# EAGLE design blinky_ver2 (EAGLE 9.6.2)
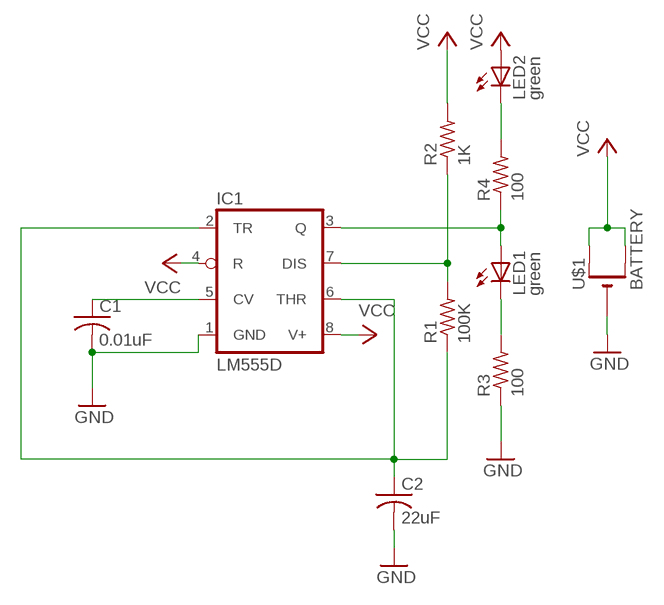
[diagram p0: schematic, sheet 1]

## Parts
C1  0.01uF  C-USC0805  [C0805]
C2  22uF  C-USC0805  [C0805]
IC1  LM555D  [SO08]
LED1  green  LEDCHIPLED_0805  [CHIPLED_0805]
LED2  green  LEDCHIPLED_0805  [CHIPLED_0805]
R1  100K  R-US_R0805  [R0805]
R2  1K  R-US_R0805  [R0805]
R3  100  R-US_R0805  [R0805]
R4  100  R-US_R0805  [R0805]
U$1  BATTERY  CR1220SMT  [CR1220-SMD]

## Nets
GND: C1.2 C2.2 IC1.1(GND) R3.1 U$1.-
N$1: LED2.C R4.2
N$2: IC1.3(Q) LED1.A R4.1
N$3: LED1.C R3.2
N$4: IC1.7(DIS) R1.2 R2.1
N$6: C1.1 IC1.5(CV)
N$7: C2.1 IC1.2(TR) IC1.6(THR) R1.1
VCC: IC1.4(R) IC1.8(V+) LED2.A R2.2 U$1.+$1(+) U$1.+$2(+1)

## Library data of the parts
C1 C2 = adafruit:C-US: CAPACITOR, American symbol
IC1 = adafruit:*555: TIMER Changed DIP package to have round (not oval) pin pads http://www.ladyada.net/library/pcb/eaglelibrary.html
LED1 LED2 = adafruit:LED: LED OSRAM: - CHIPLED LG R971, LG N971, LY N971, LG Q971, LY Q971, LO R971, LY R971 LH N974, LH R974 LS Q976, LO Q976, LY Q976 LO Q996 - Hyper CHIPLED LW Q18S LB Q993, LB Q99A, LB R99A - SideLED LS A670, LO A670, LY A670, LG A670, LP A670 LB A673, LV A673, LT A673, LW A673 LH A674 LY A675 LS A676, LA A676, LO A676, LY A676, LW A676 LS A679, LY A679, LG A679 - Hyper Micro SIDELED® LS Y876, LA Y876, LO Y876, LY Y876 LT Y87S - SmartLED LW L88C, LW L88S LB L89C, LB L89S, LG L890 LS L89K, LO L89K, LY L89K LS L896, LA L896, LO L896, LY L896 - TOPLED LS T670, LO T670, LY T670, LG T670, LP T670 LSG T670, LSP T670, LSY T670, LOP T670, LYG T670 LG T671, LOG T671, LSG T671 LB T673, LV T673, LT T673, LW T673 LH T674 LS T676, LA T676, LO T676, LY T676, LB T676, LH T676, LSB T676, LW T676 LB T67C, LV T67C, LT T67C, LS T67K, LO T67K, LY T67K, LW E67C LS E67B, LA E67B, LO E67B, LY E67B, LB E67C, LV E67C, LT E67C LW T67C LS T679, LY T679, LG T679 LS T770, LO T770, LY T770, LG T770, LP T770 LB T773, LV T773, LT T773, LW T773 LH T774 LS E675, LA E675, LY E675, LS T675 LS T776, LA T776, LO T776, LY T776, LB T776 LHGB T686 LT T68C, LB T68C - Hyper Mini TOPLED® LB M676 - Mini TOPLED Santana® LG M470 LS M47K, LO M47K, LY M47K Source: http://www.osram.convergy.de/
R1-R4 = adafruit:R-US_: RESISTOR, American symbol
U$1 = adafruit:CR1220: CR1216/CR1220/CR1225 12mm 3V lithium coin cell Great for battery packup. Both SMT and THM holders. Note the THM package has the ground pads on both sides of the PCB so that the masks are the same - this reduces the cost

## Net classes
0 default: width 0.305 mm, drill 0.508 mm, clearance 0.254 mm

## Board
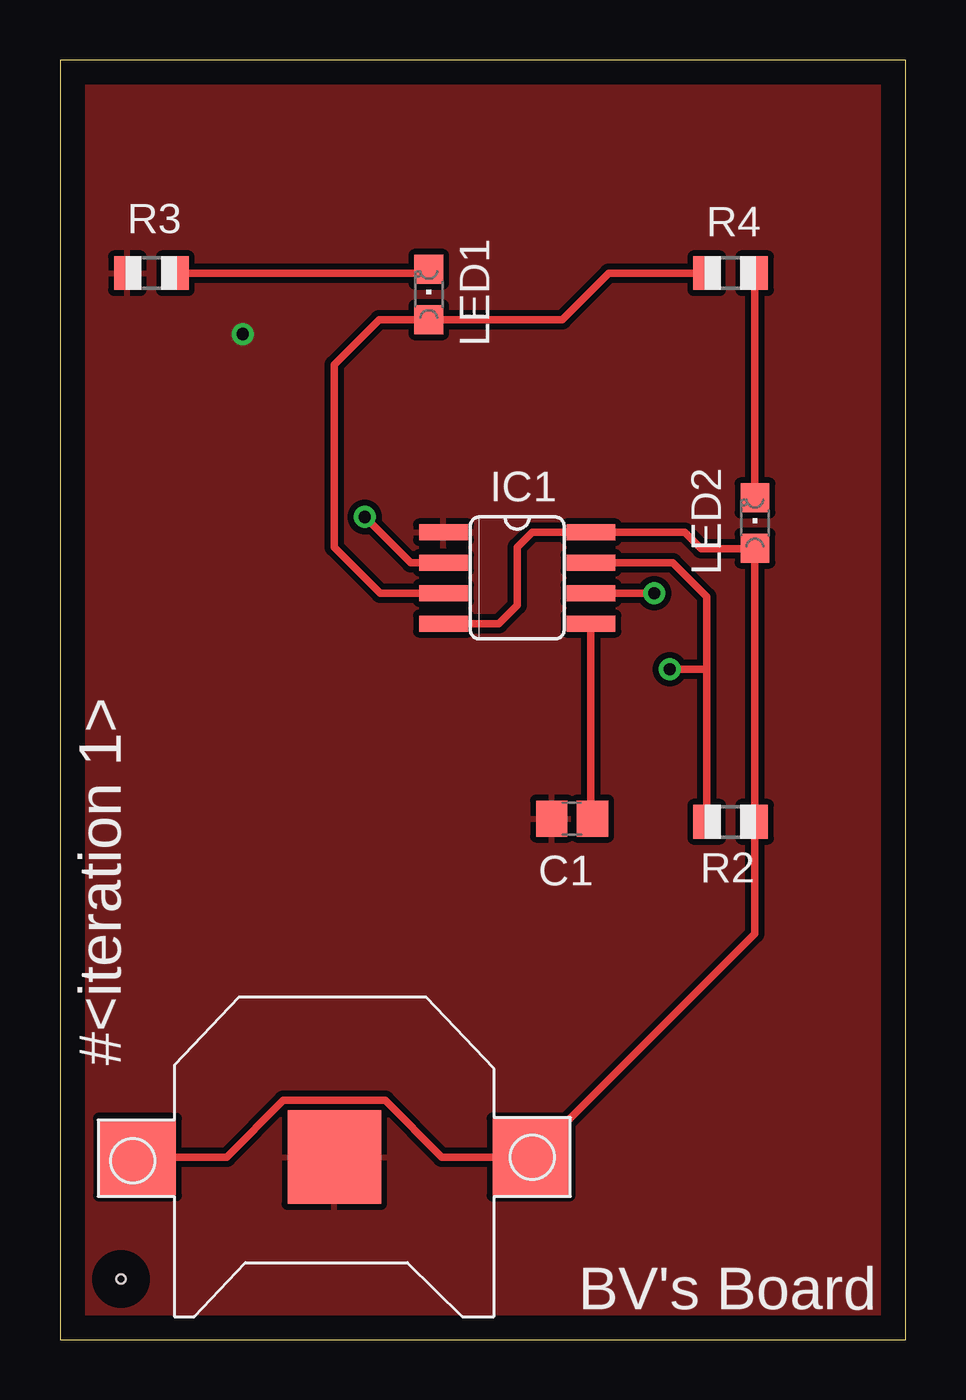
[diagram p1: board, top side]
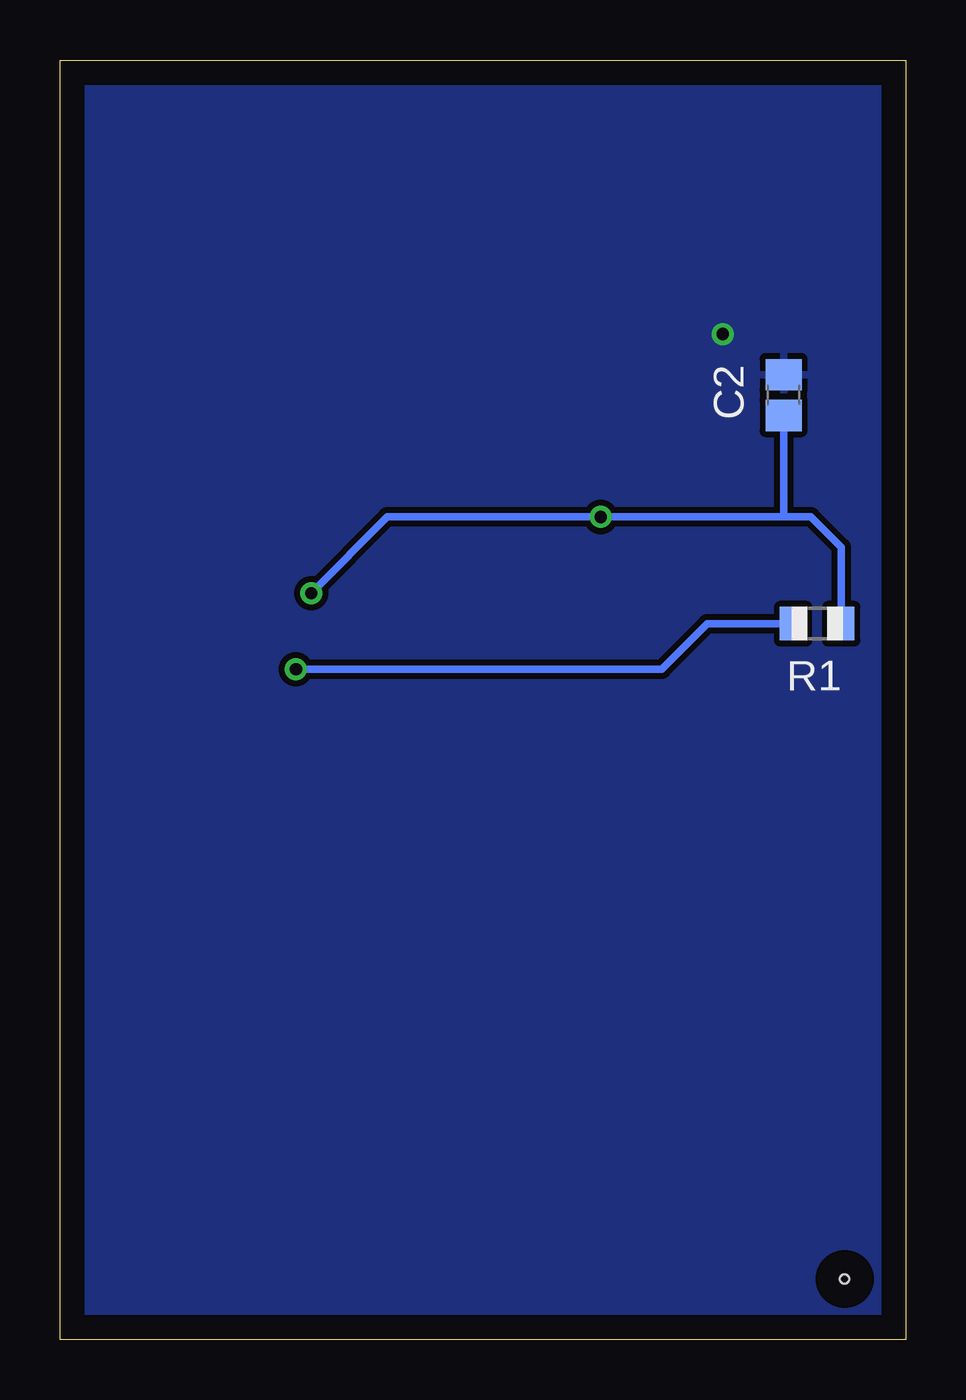
[diagram p2: board, bottom side, seen from below]

Size 35.23 x 53.33 mm. Coordinates in mm from the lower left corner, seen from the top.
Outline: 0,0 35.23,0 35.23,53.33 0,53.33 0,0
Copper layers (1*16): Top 0.035mm / dielectric 1.5mm / Bottom 0.035mm
Design rules "default": minimum track width 6mil, minimum drill 0.35mm, track to track 6mil, track to pad 6mil, pad to pad 6mil, via to via 6mil, smd to smd 6mil, copper to edge 40mil, drill to drill 6mil, minimum pad ring 10mil, minimum via ring 8mil, stop-mask expansion 4mil, vias tented up to drill 0mil, thermal gap 10mil
Holes 0.38 mm at 2.54,2.54

### Footprints (pad centres in the part's own frame; a part is rotated, then mirrored left to right if it is on the bottom)
C0805 = smd 1.3 x 1.5: 1 -0.85,0; 2 0.85,0
SO08 = smd 0.66 x 2.032: 1 -1.905,-3.073; 2 -0.635,-3.073; 3 0.635,-3.073; 4 1.905,-3.073; 5 1.905,3.073; 6 0.635,3.073; 7 -0.635,3.073; 8 -1.905,3.073
CHIPLED_0805 = smd 1.2 x 1.2: A 0,-1.05; C 0,1.05
R0805 = smd 1.1 x 1.4: 1 -1,0; 2 1,0
CR1220-SMD = smd 3.2 x 3.2: +$1 -8.2,0; +$2 8.2,0 | smd 3.9 x 3.9: - 0,0

### Placement (x,y rotation side)
C1  21.34,21.72 180 top
C2  5.08,39.37 90 bottom
IC1  19.05,31.75 270 top
LED1  15.37,43.56 0 top
LED2  28.96,34.04 0 top
R1  3.68,29.84 180 bottom
R2  27.94,21.59 0 top
R3  3.81,44.45 0 top
R4  27.94,44.45 0 top
U$1  11.43,7.62 180 top

### Tracks (layer width: path | path; a pad name or v marks a point on that pad's centre or on a via)
GND  (via drill 0.51)
  other vias: 7.62,41.91
  pour Top: -1.27,-1.27 36.83,-1.27 36.83,54.61 -1.27,54.61
  pour Bottom: -1.27,54.61 36.83,54.61 36.83,-1.27 -1.27,-1.27
N$1
  Top 0.305: R4.2 28.94,35.1 LED2.C
N$2
  Top 0.305: IC1.3 13.34,31.11 11.43,33.02 11.43,40.64 13.3,42.51 LED1.A 20.92,42.51 22.86,44.45 R4.1
N$3
  Top 0.305: LED1.C 15.21,44.45 R3.2
N$4  (via drill 0.51)
  Top 0.305: IC1.7 25.53,32.38 26.94,30.97 26.94,27.94 | 26.94,27.94 R2.1 | v25.4,27.94 26.94,27.94
  Bottom 0.305: R1.2 8.26,29.84 10.16,27.94 v25.4,27.94
N$6
  Top 0.305: IC1.5 22.12,21.78 C1.1
N$7  (via drill 0.51)
  Top 0.305: IC1.2 14.61,32.38 v12.7,34.29 | IC1.6 v24.77,31.11
  Bottom 0.305: R1.1 2.68,33.02 3.95,34.29 5.08,34.29 | 5.08,34.29 v12.7,34.29 21.59,34.29 v24.77,31.11 | 5.08,34.29 C2.1
VCC
  Top 0.305: 28.94,32.97 R2.2 28.94,16.93 U$1.+$1 15.9,7.62 13.55,9.98 9.31,9.98 6.96,7.62 U$1.+$2 | 28.94,32.97 LED2.A | 28.94,32.97 26.72,32.97 26.04,33.66 IC1.8 19.68,33.66 19.05,33.02 19.05,30.61 18.29,29.84 IC1.4

### Text on the board
tPlace: #<iteration 1> | BV's Board